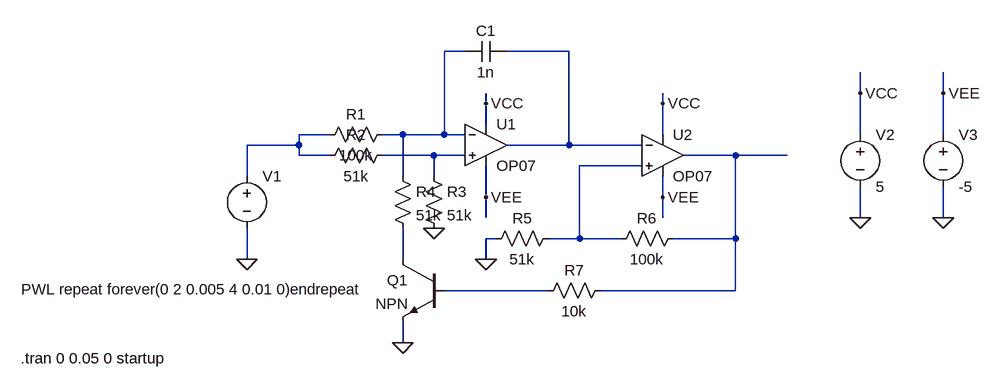
[diagram p0: schematic Draft5.asc]
Draft5.asc, the LTspice schematic file:
Version 4
SHEET 1 888 680
WIRE 96 32 64 32
WIRE 256 32 160 32
WIRE 704 96 704 64
WIRE 832 96 832 64
WIRE 128 112 128 96
WIRE 400 112 400 96
WIRE 128 144 128 112
WIRE -112 160 -160 160
WIRE 0 160 -32 160
WIRE 64 160 64 32
WIRE 64 160 0 160
WIRE 96 160 64 160
WIRE 400 160 400 112
WIRE 704 160 704 96
WIRE 832 160 832 96
WIRE -160 176 -160 160
WIRE -160 176 -240 176
WIRE 256 176 256 32
WIRE 256 176 160 176
WIRE 368 176 256 176
WIRE -160 192 -160 176
WIRE -112 192 -160 192
WIRE 48 192 -32 192
WIRE 96 192 48 192
WIRE 512 192 432 192
WIRE 592 192 512 192
WIRE 368 208 272 208
WIRE -240 224 -240 176
WIRE 0 224 0 160
WIRE 48 224 48 192
WIRE 128 256 128 208
WIRE 400 256 400 224
WIRE 128 288 128 256
WIRE 400 288 400 256
WIRE 704 288 704 240
WIRE 832 288 832 240
WIRE 144 320 128 320
WIRE 272 320 272 208
WIRE 272 320 224 320
WIRE 336 320 272 320
WIRE 512 320 512 192
WIRE 512 320 416 320
WIRE -240 352 -240 304
WIRE 0 352 0 304
WIRE 128 352 128 320
WIRE 224 400 64 400
WIRE 512 400 512 320
WIRE 512 400 304 400
WIRE 0 480 0 448
FLAG 48 304 0
FLAG 0 480 0
FLAG 128 352 0
FLAG -240 352 0
FLAG 704 288 0
FLAG 832 288 0
FLAG 128 112 VCC
FLAG 400 112 VCC
FLAG 704 96 VCC
FLAG 128 256 VEE
FLAG 400 256 VEE
FLAG 832 96 VEE
SYMBOL OpAmps\\OP07 128 112 R0
SYMATTR InstName U1
SYMBOL OpAmps\\OP07 400 128 R0
SYMATTR InstName U2
SYMBOL res -16 144 R90
WINDOW 0 0 56 VBottom 2
WINDOW 3 32 56 VTop 2
SYMATTR InstName R1
SYMATTR Value 100k
SYMBOL res -16 176 R90
WINDOW 0 0 56 VBottom 2
WINDOW 3 32 56 VTop 2
SYMATTR InstName R2
SYMATTR Value 51k
SYMBOL cap 160 16 R90
WINDOW 0 0 32 VBottom 2
WINDOW 3 32 32 VTop 2
SYMATTR InstName C1
SYMATTR Value 1n
SYMBOL res 32 208 R0
SYMATTR InstName R3
SYMATTR Value 51k
SYMBOL res -16 208 R0
SYMATTR InstName R4
SYMATTR Value 51k
SYMBOL res 240 304 R90
WINDOW 0 0 56 VBottom 2
WINDOW 3 32 56 VTop 2
SYMATTR InstName R5
SYMATTR Value 51k
SYMBOL res 432 304 R90
WINDOW 0 0 56 VBottom 2
WINDOW 3 32 56 VTop 2
SYMATTR InstName R6
SYMATTR Value 100k
SYMBOL res 320 384 R90
WINDOW 0 0 56 VBottom 2
WINDOW 3 32 56 VTop 2
SYMATTR InstName R7
SYMATTR Value 10k
SYMBOL npn 64 352 M0
SYMATTR InstName Q1
SYMBOL voltage -240 208 R0
WINDOW 3 -347 190 Left 2
SYMATTR InstName V1
SYMATTR Value PWL repeat forever(0 2 0.005 4 0.01 0)endrepeat
SYMBOL voltage 704 144 R0
WINDOW 123 0 0 Left 0
WINDOW 39 0 0 Left 0
SYMATTR InstName V2
SYMATTR Value 5
SYMBOL voltage 832 144 R0
WINDOW 123 0 0 Left 0
WINDOW 39 0 0 Left 0
SYMATTR InstName V3
SYMATTR Value -5
TEXT -588 504 Left 2 !.tran 0 0.05 0 startup

The netlist it stands for:
* Draft5.asc
XU1 N004 N001 VCC VEE N002 LT1001  ; OP07, pins In+ In- V+ V- OUT
XU2 N006 N002 VCC VEE N005 LT1001  ; OP07, pins In+ In- V+ V- OUT
R1 N001 N003 100k
R2 N004 N003 51k
C1 N002 N001 1n
R3 N004 0 51k
R4 N001 N007 51k
R5 N006 0 51k
R6 N005 N006 100k
R7 N005 N008 10k
Q1 N007 N008 0 0 NPN
V1 N003 0 PWL repeat forever(0 2 0.005 4 0.01 0)endrepeat
V2 VCC 0 5
V3 VEE 0 -5
.model NPN NPN
.model PNP PNP
.lib standard.bjt
.tran 0 0.05 0 startup
.lib LTC.lib
.backanno
.end

* Results of the author's LTspice run, read from the files saved beside the schematic
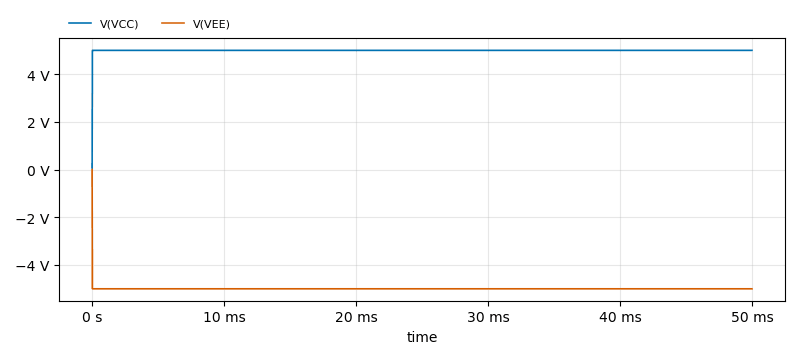
[diagram p1: Transient Analysis of Draft5.asc, plotted from the saved traces]
* Transient Analysis, 1 run:
*   V(VCC): min 0 V, max 5 V, average 4.999 V, rms 4.999 V, last 5 V
*   V(VEE): min -5 V, max 0 V, average -4.999 V, rms 4.999 V, last -5 V